# EAGLE design v1 (EAGLE 7.3.0)
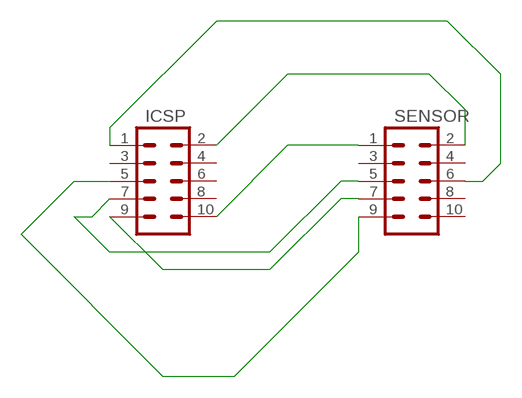
[diagram p0: schematic, sheet 1]

## Parts
ICSP  M05X2PTH  [AVR_ICSP]
SENSOR  M05X2PTH  [AVR_ICSP]

## Nets
N$1: ICSP.10 SENSOR.1
N$2: ICSP.2 SENSOR.2
N$3: ICSP.1 SENSOR.6
N$4: ICSP.9 SENSOR.7
N$5: ICSP.7 SENSOR.5
N$6: ICSP.5 SENSOR.9
Unconnected: ICSP.3 ICSP.4 ICSP.6 ICSP.8 SENSOR.3 SENSOR.4 SENSOR.8 SENSOR.10

## Library data of the parts
ICSP SENSOR = SparkFun-Connectors:M05X2: Header 5x2 Standard 10-pin dual row 0.1" header. Commonly used with AVR-ISP. Use with Spark Fun Electronics SKU: PRT-00778

## Board
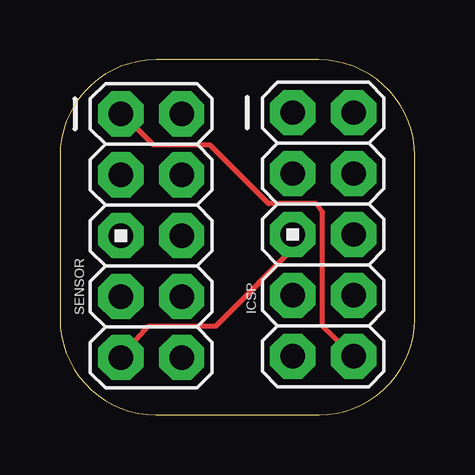
[diagram p1: board, top side]
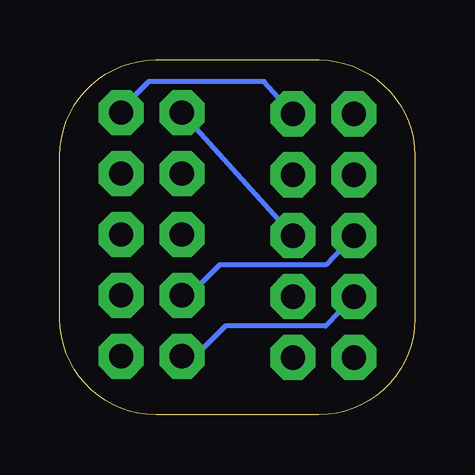
[diagram p2: board, bottom side, seen from below]

Size 14.8 x 14.8 mm. Coordinates in mm from the lower left corner, seen from the top.
Outline: 0,10.8 0,4 arc90 4,0 10.8,0 arc90 14.8,4 14.8,10.8 arc90 10.8,14.8 4,14.8 arc90 0,10.8
Copper layers (1*16): Top 0.035mm / dielectric 1.5mm / Bottom 0.035mm
Design rules "DFRobot_Eagle_Rule_v0.4": minimum track width 6mil, minimum drill 12mil, track to track 6mil, track to pad 6mil, pad to pad 6mil, via to via 6mil, smd to smd 0mil, copper to edge 10mil, drill to drill 10mil, minimum pad ring 12mil, minimum via ring 8mil, stop-mask expansion 2mil, vias tented up to drill 25mil, thermal gap 10mil

### Footprints (pad centres in the part's own frame; a part is rotated, then mirrored left to right if it is on the bottom)
AVR_ICSP = drill 1.016 pad 1.88 octagon: 1 -1.27,5.08; 2 1.27,5.08; 3 -1.27,2.54; 4 1.27,2.54; 5 -1.27,0; 6 1.27,0; 7 -1.27,-2.54; 8 1.27,-2.54; 9 -1.27,-5.08; 10 1.27,-5.08

### Placement (x,y rotation side)
ICSP  10.98,7.52 0 top
SENSOR  3.81,7.47 0 top

### Tracks (layer width: path | path; a pad name or v marks a point on that pad's centre or on a via)
N$1
  Top 0.2: ICSP.10 10.95,3.69 10.95,8.45 10.7,8.8 8.7,8.8 6.25,11.25 3.9,11.25 2.55,12.6 SENSOR.1
N$2
  Bottom 0.2: SENSOR.2 6.28,13.9 11.1,13.9 12.4,12.6 ICSP.2
N$3
  Bottom 0.2: SENSOR.6 ICSP.1
N$4
  Bottom 0.2: SENSOR.7 3.72,3.7 7.9,3.7 9.16,2.44 ICSP.9
N$5
  Bottom 0.2: SENSOR.5 3.71,6.25 8.15,6.25 9.42,4.98 ICSP.7
N$6
  Top 0.2: SENSOR.9 3.7,3.7 6.5,3.7 10.06,7.26 ICSP.5